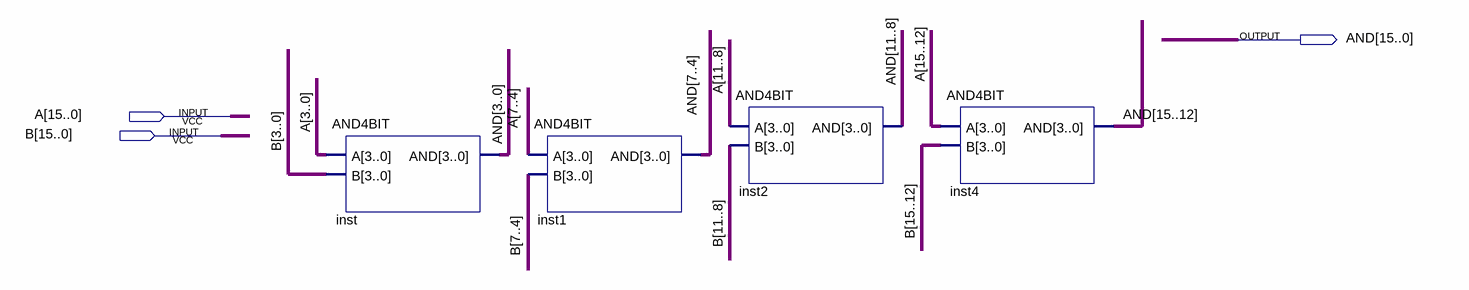
[diagram p0: schematic sheet]
// Quartus schematic AND16BIT.bdf as structural Verilog: 4 symbols, 3 pins
module AND16BIT (
  input  [15:0] A,
  input  [15:0] B,
  output [15:0] AND
);

  AND4BIT inst (.A(A[3:0]), .B(B[3:0]), .AND(AND[3:0]));
  AND4BIT inst1 (.A(A[7:4]), .B(B[7:4]), .AND(AND[7:4]));
  AND4BIT inst2 (.A(A[11:8]), .B(B[11:8]), .AND(AND[11:8]));
  AND4BIT inst4 (.A(A[15:12]), .B(B[15:12]), .AND(AND[15:12]));
endmodule
